# Altium schematic sheet PFC control board.SchDoc
size B; Organization: Altium Limited; Address1: L3, 12a Rodborough Rd; Address2: Frenchs Forest; Address3: NSW; Address4: Australia 2086; SheetNumber: 1; SheetTotal: 1
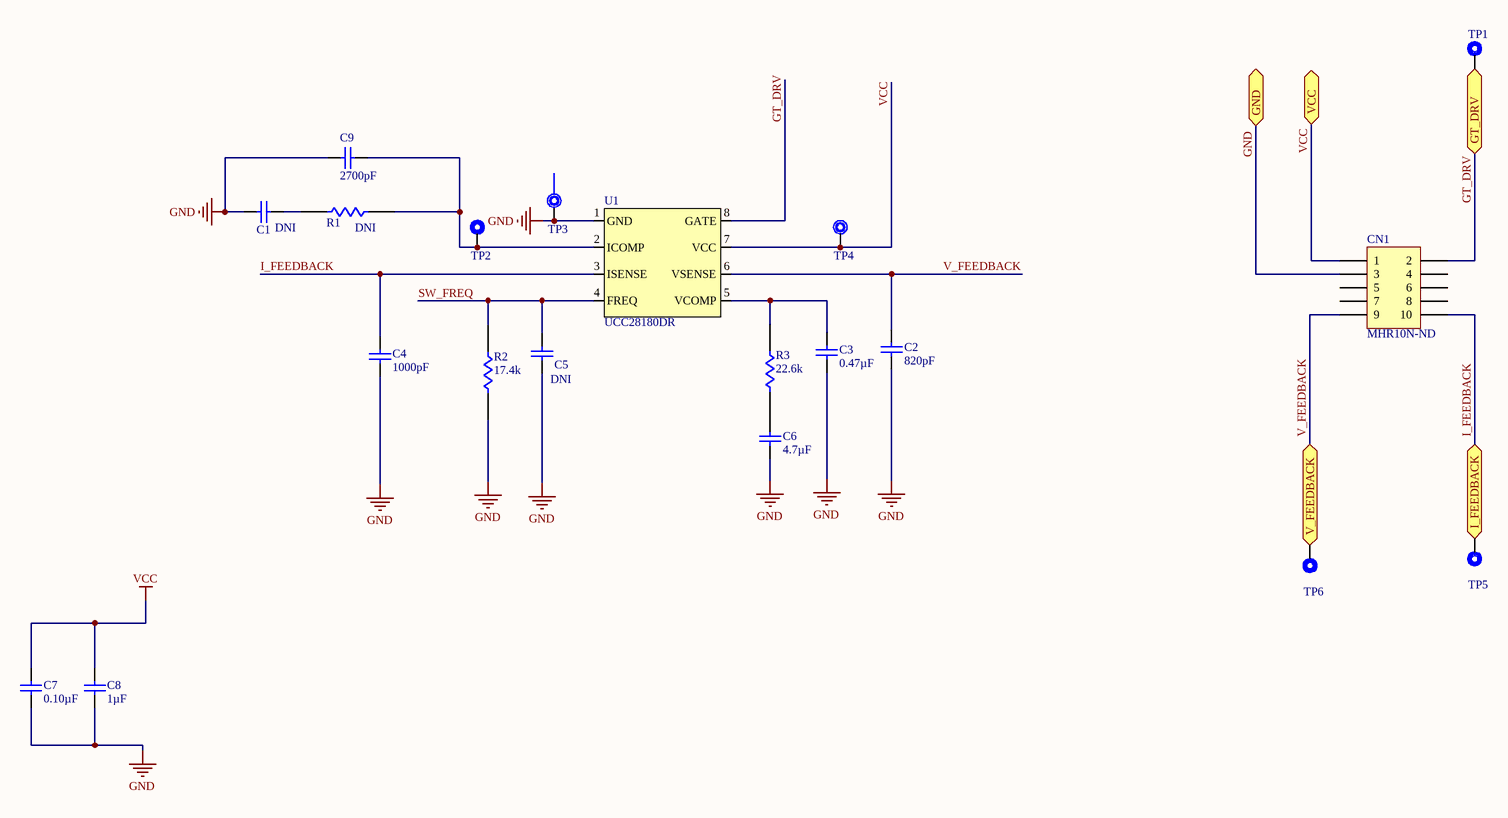
[diagram p0: PFC control board.SchDoc]

## Parts
C1  C0603--  [CAP0603]  (value not drawn)
C2  Capacitance: 820pF  [CAP0603]  (hidden comment: C0603C821K5RACTU)
C3  Capacitance: 0.47µF  [CAP0603]  (hidden comment: C0603C474K4RACTU)
C4  Capacitance: 1000pF  [CAP0603]  (hidden comment: 06031C102KAT2A)
C5  C0603--  [CAP0603]  (value not drawn)
C6  Capacitance: 4.7µF  [CAP0805]  (hidden comment: GRM21BR71A475KA73L)
C7  Capacitance: 0.10µF  [CAP0603]  (hidden comment: 06035C104KAT2A)
C8  Capacitance: 1µF  [CAP1206]  (hidden comment: GRM32RR71H105KA01K)
C9  Capacitance: 2700pF  [CAP0603]  (hidden comment: GRM188R71H272KA01D)
CN1  MHR10N-ND  [3M15452]
R1  CRCW0603--  [RES0603]  (value not drawn)
R2  Resistance (Ohms): 17.4k  [RES0603]  (hidden comment: CRCW060317K4FKEB)
R3  Resistance (Ohms): 22.6k  [CAP0603]  (hidden comment: CRCW060322K6FKEA)
TP1  5006  [Test Point]  (value not drawn)
TP2  5006  [Test Point]  (value not drawn)
TP3  TP-Slot  [TP-Slot]  (value not drawn)
TP4  TP-SM  [TP-SM]  (value not drawn)
TP5  5006  [Test Point]  (value not drawn)
TP6  5006  [Test Point]  (value not drawn)
U1  UCC28180DR  [SOP127P600X175-8N]

## Ports
GND, GT_DRV, I_FEEDBACK, V_FEEDBACK, VCC

## Nets
GND: C1.1 C2.1 C3.1 C4.1 C5.1 C6.1 C7.2 C8.1 C9.1 CN1.3 R2.2 TP3.1 U1.1(GND) ; port GND
VCC: C7.1 C8.2 CN1.1 TP4.1 U1.7(VCC) ; port VCC
GT_DRV: CN1.2 TP1.1 U1.8(GATE) ; port GT_DRV
I_FEEDBACK: C4.2 CN1.10 TP5.1 U1.3(ISENSE) ; port I_FEEDBACK
SW_FREQ: C5.2 R2.1 U1.4(FREQ)
V_FEEDBACK: C2.2 CN1.9 TP6.1 U1.6(VSENSE) ; port V_FEEDBACK
NetC1_2: C1.2 R1.2
NetC3_2: C3.2 R3.1 U1.5(VCOMP)
NetC6_2: C6.2 R3.2
NetC9_2: C9.2 R1.1 TP2.1 U1.2(ICOMP)

Not connected (* = marked no-connect by the designer): CN1 4 5 6 7 8

## Notes on the sheet
- (near C1) DNI
- (near R1) DNI
- (near C5) DNI
- Title:
- Size:
- B
- Document Number:
- Revision:
- Designer:
- Approval Date:
- Start Date:
- MM/DD/YY
- --/--/--
- Sheet:
- of
- Approver:
- CONFIDENTIAL
- Project Name/Number:

## Library data of the parts
C2 = C0603C821K5RACTU: CAP CER 820PF 50V X7R 0603; Manufacturer 1: KEMET; Category 1: Capacitors; Tolerance: ±10%; Supplier 1: Digi-Key; Supplier Part Number 1: 399-1078-1-ND; Manufacturer Part Number 1: C0603C821K5RACTU; RoHS 1: RoHS Compliant; Description 1: CAP CER 820PF 50V X7R 0603; Stock 1: 19858; Pricing 1: 1=0.1, 10=0.052, 25=0.0376, 50=0.0282, 100=0.023, 250=0.01928, 500=0.01646, 1000=0.01293 (USD); Packaging: Cut Tape (CT); Part Status: Active; Voltage - Rated: 50V; Temperature Coefficient: X7R; Operating Temperature: -55°C ~ 125°C; Features: -; Ratings: -; Applications: General Purpose; Failure Rate: -; Mounting Type: Surface Mount, MLCC; Package / Case: 0603 (1608 Metric); Size / Dimension: 0.063" L x 0.031" W (1.60mm x 0.80mm); Height - Seated (Max): -; Thickness (Max): 0.034" (0.87mm); Lead Spacing: -; Lead Style: -; ComponentLink1URL: http://www.kemet.com/docfinder?Partnumber=C0603C821K5RACTU; ComponentLink1Description: http://www.kemet.com/docfinder?Partnumber=C0603C821K5RACTU
C3 = C0603C474K4RACTU: CAP CER 0.47UF 16V X7R 0603; Manufacturer 1: KEMET; Category 1: Capacitors; Tolerance: ±10%; Supplier 1: Digi-Key; Supplier Part Number 1: 399-4922-1-ND; Manufacturer Part Number 1: C0603C474K4RACTU; RoHS 1: RoHS Compliant; Description 1: CAP CER 0.47UF 16V X7R 0603; Stock 1: 196985; Pricing 1: 1=0.15, 10=0.104, 25=0.0756, 50=0.0588, 100=0.0487, 250=0.04032, 500=0.03416, 1000=0.02828 (USD); Packaging: Cut Tape (CT); Part Status: Active; Voltage - Rated: 16V; Temperature Coefficient: X7R; Operating Temperature: -55°C ~ 125°C; Features: -; Ratings: -; Applications: General Purpose; Failure Rate: -; Mounting Type: Surface Mount, MLCC; Package / Case: 0603 (1608 Metric); Size / Dimension: 0.063" L x 0.031" W (1.60mm x 0.80mm); Height - Seated (Max): -; Thickness (Max): 0.034" (0.87mm); Lead Spacing: -; Lead Style: -; ComponentLink1URL: http://www.kemet.com/docfinder?Partnumber=C0603C474K4RACTU; ComponentLink1Description: http://www.kemet.com/docfinder?Partnumber=C0603C474K4RACTU
C4 = 06031C102KAT2A: CAP CER 1000PF 100V X7R 0603; Manufacturer 1: AVX Corporation; Category 1: Capacitors; Tolerance: ±10%; Supplier 1: Digi-Key; Supplier Part Number 1: 478-1199-1-ND; Manufacturer Part Number 1: 06031C102KAT2A; RoHS 1: RoHS Compliant; Description 1: CAP CER 1000PF 100V X7R 0603; Stock 1: 182503; Pricing 1: 1=0.1, 10=0.037, 25=0.0268, 50=0.0202, 100=0.0165, 250=0.01376, 500=0.01176, 1000=0.00924 (USD); Packaging: Cut Tape (CT); Part Status: Active; Voltage - Rated: 100V; Temperature Coefficient: X7R; Operating Temperature: -55°C ~ 125°C; Features: -; Ratings: -; Applications: General Purpose; Mounting Type: Surface Mount, MLCC; Package / Case: 0603 (1608 Metric); Size / Dimension: 0.063" L x 0.032" W (1.60mm x 0.81mm); Height - Seated (Max): -; Thickness (Max): 0.035" (0.90mm); Lead Spacing: -; Lead Style: -; ComponentLink1URL: http://datasheets.avx.com/X7RDielectric.pdf; ComponentLink1Description: http://datasheets.avx.com/X7RDielectric.pdf
C6 = GRM21BR71A475KA73L: CAP CER 4.7UF 10V X7R 0805; Manufacturer 1: Murata Electronics North America; Category 1: Capacitors; Tolerance: ±10%; Supplier 1: Digi-Key; Supplier Part Number 1: 490-6480-1-ND; Manufacturer Part Number 1: GRM21BR71A475KA73L; RoHS 1: RoHS Compliant; Description 1: CAP CER 4.7UF 10V X7R 0805; Stock 1: 55696; Pricing 1: 1=0.27, 10=0.182, 50=0.11, 100=0.0924 (USD); Packaging: Cut Tape (CT); Part Status: Active; Voltage - Rated: 10V; Temperature Coefficient: X7R; Operating Temperature: -55°C ~ 125°C; Features: -; Ratings: -; Applications: General Purpose; Mounting Type: Surface Mount, MLCC; Package / Case: 0805 (2012 Metric); Size / Dimension: 0.079" L x 0.049" W (2.00mm x 1.25mm); Height - Seated (Max): -; Thickness (Max): 0.053" (1.35mm); Lead Spacing: -; Lead Style: -; ComponentLink1URL: http://www.murata.com/~/media/webrenewal/support/library/catalog/products/capacitor/mlcc/c02e.pdf; ComponentLink1Description: http://www.murata.com/~/media/webrenewal/support/library/catalog/products/capacitor/mlcc/c02e.pdf
C7 = 06035C104KAT2A: CAP CER 0.1UF 50V X7R 0603; Manufacturer 1: AVX Corporation; Category 1: Capacitors; Tolerance: ±10%; Supplier 1: Digi-Key; Supplier Part Number 1: 478-5052-6-ND; Manufacturer Part Number 1: 06035C104KAT2A; RoHS 1: RoHS Compliant; Description 1: CAP CER 0.1UF 50V X7R 0603; Stock 1: 1164910; Pricing 1: 1=0.1, 10=0.037, 25=0.0268, 50=0.0202, 100=0.0165, 250=0.01376, 500=0.01176, 1000=0.00924 (USD); Packaging: Digi-Reel®; Part Status: Active; Voltage - Rated: 50V; Temperature Coefficient: X7R; Operating Temperature: -55°C ~ 125°C; Features: -; Ratings: -; Applications: General Purpose; Mounting Type: Surface Mount, MLCC; Package / Case: 0603 (1608 Metric); Size / Dimension: 0.063" L x 0.032" W (1.60mm x 0.81mm); Height - Seated (Max): -; Thickness (Max): 0.035" (0.90mm); Lead Spacing: -; Lead Style: -; ComponentLink1URL: http://datasheets.avx.com/X7RDielectric.pdf; ComponentLink1Description: http://datasheets.avx.com/X7RDielectric.pdf
C8 = GRM32RR71H105KA01K: CAP CER 1UF 50V X7R 1210; Manufacturer 1: Murata Electronics North America; Category 1: Capacitors; Tolerance: ±10%; Description 2: CAP CER 0.1UF 50V X7R 1206; Supplier 1: Digi-Key; Supplier Part Number 1: 490-11661-1-ND; Manufacturer Part Number 1: GRM32RR71H105KA01K; RoHS 1: RoHS Compliant; Description 1: CAP CER 1UF 50V X7R 1210; Stock 1: 3574; Pricing 1: 1=0.32, 10=0.28, 50=0.17, 100=0.14, 250=0.112, 500=0.102, 1000=0.092 (USD); Packaging: Cut Tape (CT); Part Status: Active; Voltage - Rated: 50V; Temperature Coefficient: X7R; Operating Temperature: -55°C ~ 125°C; Features: -; Ratings: -; Applications: General Purpose; Mounting Type: Surface Mount, MLCC; Package / Case: 1210 (3225 Metric); Size / Dimension: 0.126" L x 0.098" W (3.20mm x 2.50mm); Height - Seated (Max): -; Thickness (Max): 0.079" (2.00mm); Lead Spacing: -; Lead Style: -; ComponentLink1URL: http://www.murata.com/~/media/webrenewal/support/library/catalog/products/capacitor/mlcc/c02e.pdf; ComponentLink1Description: http://www.murata.com/~/media/webrenewal/support/library/catalog/products/capacitor/mlcc/c02e.pdf; Supplier 2: Digi-Key; Supplier Part Number 2: 478-1556-1-ND; Manufacturer 2: AVX Corporation; Manufacturer Part Number 2: 12065C104KAT2A; RoHS 2: RoHS Compliant; Category 2: Capacitors; Stock 2: 1310883; Pricing 2: 1=0.1, 10=0.073, 25=0.0528, 50=0.0412, 100=0.0341, 250=0.02824, 500=0.02392, 1000=0.0198 (USD); ComponentLink2URL: http://datasheets.avx.com/X7RDielectric.pdf; ComponentLink2Description: http://datasheets.avx.com/X7RDielectric.pdf
C9 = GRM188R71H272KA01D: CAP CER 2700PF 50V X7R 0603; Manufacturer 1: Murata Electronics North America; Category 1: Capacitors; Tolerance: ±10%; Supplier 1: Digi-Key; Supplier Part Number 1: 490-1502-6-ND; Manufacturer Part Number 1: GRM188R71H272KA01D; RoHS 1: RoHS Compliant; Description 1: CAP CER 2700PF 50V X7R 0603; Stock 1: 42465; Pricing 1: 1=0.1, 10=0.064, 25=0.0452, 50=0.0344, 100=0.0292, 250=0.02384, 500=0.0204, 1000=0.0159 (USD); Packaging: Digi-Reel®; Part Status: Active; Voltage - Rated: 50V; Temperature Coefficient: X7R; Operating Temperature: -55°C ~ 125°C; Features: -; Ratings: -; Applications: General Purpose; Mounting Type: Surface Mount, MLCC; Package / Case: 0603 (1608 Metric); Size / Dimension: 0.063" L x 0.031" W (1.60mm x 0.80mm); Height - Seated (Max): -; Thickness (Max): 0.035" (0.90mm); Lead Spacing: -; Lead Style: -; ComponentLink1URL: http://www.murata.com/~/media/webrenewal/support/library/catalog/products/capacitor/mlcc/c02e.pdf; ComponentLink1Description: http://www.murata.com/~/media/webrenewal/support/library/catalog/products/capacitor/mlcc/c02e.pdf
CN1 = MHR10N-ND: CONN HEADER 10PS R/A LONG LATCH; Manufacturer: 3M; Manufacturer Part Number: N3793-5302RB; Pitch - Mating: 0.100" (2.54mm); Style: Board to Board or Cable; Shrouding: Shrouded - 4 Wall; Number of Positions: 10; Number of Positions Loaded: All; Contact Length - Mating: 0.240" (6.10mm); Contact Length - Post: 0.112" (2.84mm); Material Flammability Rating: UL94 V-0; Current Rating: 1.75A; Supplier 1: Digi-Key; RoHS: RoHS Compliant; Category: Connectors, Interconnects; Stock 1: 2811; Pricing 1: 1=1.86, 10=1.691, 100=1.449, 500=1.2075, 1000=1.035, 5000=0.9177, 10000=0.897 (USD); Packaging: Bulk; Part Status: Active; Connector Type: Header; Contact Type: Male Pin; Number of Rows: 2; Row Spacing - Mating: 0.100" (2.54mm); Mounting Type: Through Hole, Right Angle; Termination: Solder; Fastening Type: Latch Lock/Eject Hooks, Long; Overall Contact Length: -; Insulation Height: 0.340" (8.64mm); Contact Shape: Square; Contact Finish - Mating: Gold; Contact Finish Thickness - Mating: 30µin (0.76µm); Contact Finish - Post: Tin; Contact Material: Copper Alloy; Insulation Material: Polycyclohexylenedimethylene Terephthalate (PCT), Polyester, Glass Filled; Features: Keying Slot, Mounting Flange; Operating Temperature: -55°C ~ 105°C; Ingress Protection: -; Insulation Color: Black; Voltage Rating: -; Mated Stacking Heights: -; Contact Finish Thickness - Post: 200µin (5.08µm); Applications: -; ComponentLink1URL: http://multimedia.3m.com/mws/media/22448O/3m-four-wall-header-3000-series-100-x-100-ts-0772.pdf; ComponentLink1Description: http://multimedia.3m.com/mws/media/22448O/3m-four-wall-header-3000-series-100-x-100-ts-0772.pdf; Supplier Part Number 1: MHR10N-ND
R2 = CRCW060317K4FKEB: RES SMD 17.4K OHM 1% 1/10W 0603; Manufacturer: Vishay Dale; Power (Watts): 0.1W, 1/10W; Temperature Coefficient: ±100ppm/°K; Supplier 1: Digi-Key; Manufacturer Part Number: CRCW060317K4FKEB; RoHS: RoHS Compliant; Category: Resistors; Stock 1: 0; Pricing 1: 20000=0.00361, 30000=0.00317, 50000=0.00291, 100000=0.00285 (USD); Packaging: Tape & Reel (TR); Part Status: Active; Tolerance: ±1%; Composition: Thick Film; Features: Automotive AEC-Q200; Operating Temperature: -55°C ~ 155°C; Package / Case: 0603 (1608 Metric); Supplier Device Package: 0603; Size / Dimension: 0.063" L x 0.033" W (1.60mm x 0.85mm); Height - Seated (Max): 0.020" (0.50mm); Failure Rate: -; ComponentLink1URL: http://www.vishay.com/docs/20035/dcrcwe3.pdf; ComponentLink1Description: http://www.vishay.com/docs/20035/dcrcwe3.pdf; Supplier Part Number 1: CRCW060317K4FKEB-ND
R3 = CRCW060322K6FKEA: RES SMD 22.6K OHM 1% 1/10W 0603; Manufacturer 1: Vishay Dale; Category 1: Resistors; Power (Watts): 0.1W, 1/10W; Temperature Coefficient: ±100ppm/°C; Supplier 1: Digi-Key; Supplier Part Number 1: 541-22.6KHCT-ND; Manufacturer Part Number 1: CRCW060322K6FKEA; RoHS 1: RoHS Compliant; Description 1: RES SMD 22.6K OHM 1% 1/10W 0603; Stock 1: 27075; Pricing 1: 1=0.1, 10=0.03, 25=0.022, 50=0.0168, 100=0.0123, 250=0.0094, 500=0.00752, 1000=0.00554 (USD); Packaging: Cut Tape (CT); Part Status: Active; Tolerance: ±1%; Composition: Thick Film; Features: Automotive AEC-Q200; Operating Temperature: -55°C ~ 155°C; Package / Case: 0603 (1608 Metric); Supplier Device Package: 0603; Size / Dimension: 0.063" L x 0.033" W (1.60mm x 0.85mm); Height - Seated (Max): 0.020" (0.50mm); Number of Terminations: 2; Failure Rate: -; ComponentLink1URL: http://www.vishay.com/docs/20035/dcrcwe3.pdf; ComponentLink1Description: http://www.vishay.com/docs/20035/dcrcwe3.pdf
TP1 TP2 TP5 TP6 = 5006: TEST POINT PC COMPACT .063"D BLK; Manufacturer 1: Keystone Electronics; Category 1: Test and Measurement; Plating: Silver; Material - Insulation: Nylon 46, UL 94V-0; Material - Body: Phosphor Bronze; Supplier 1: Digi-Key; Supplier Part Number 1: 36-5006-ND; Manufacturer Part Number 1: 5006; RoHS 1: RoHS Compliant; Description 1: TEST POINT PC COMPACT .063"D BLK; Stock 1: 199444; Pricing 1: 1=0.37, 10=0.316, 50=0.2298, 100=0.2209, 250=0.19832, 500=0.18932, 1000=0.1616, 2500=0.14424, 5000=0.13523 (USD); Packaging: Bulk; Part Status: Active; Type: PC Test Point, Compact; Mounting Type: 0.063" (1.60mm) Hole Diameter; Color: Black; Size / Dimension: 0.125" Dia x 0.220" L (3.18mm x 5.59mm); ComponentLink1URL: http://www.keyelco.com/product-pdf.cfm?p=1314; ComponentLink1Description: http://www.keyelco.com/product-pdf.cfm?p=1314
U1 = UCC28180DR: IC PFC CTRLR AVERAGE CURR 8SOIC; Manufacturer 1: Texas Instruments; Category 1: Integrated Circuits (ICs); Mode: Continuous Conduction (CCM); Frequency - Switching: 18kHz ~ 250kHz; Current - Startup: 75µA; Voltage - Supply: 21V; Supplier 1: Digi-Key; Supplier Part Number 1: 296-44502-2-ND; Manufacturer Part Number 1: UCC28180DR; RoHS 1: RoHS Compliant; Description 1: IC PFC CTRLR AVERAGE CURR 8SOIC; Stock 1: 5000; Pricing 1: 2500=0.50625 (USD); Packaging: Tape & Reel (TR); Part Status: Active; Operating Temperature: -40°C ~ 125°C; Mounting Type: Surface Mount; Package / Case: 8-SOIC (0.154", 3.90mm Width); Supplier Device Package: 8-SOIC; ComponentLink1URL: http://www.ti.com/lit/ds/symlink/ucc28180.pdf; ComponentLink1Description: http://www.ti.com/lit/ds/symlink/ucc28180.pdf